# Altium schematic sheet swivel_rev2.SchDoc
size A3
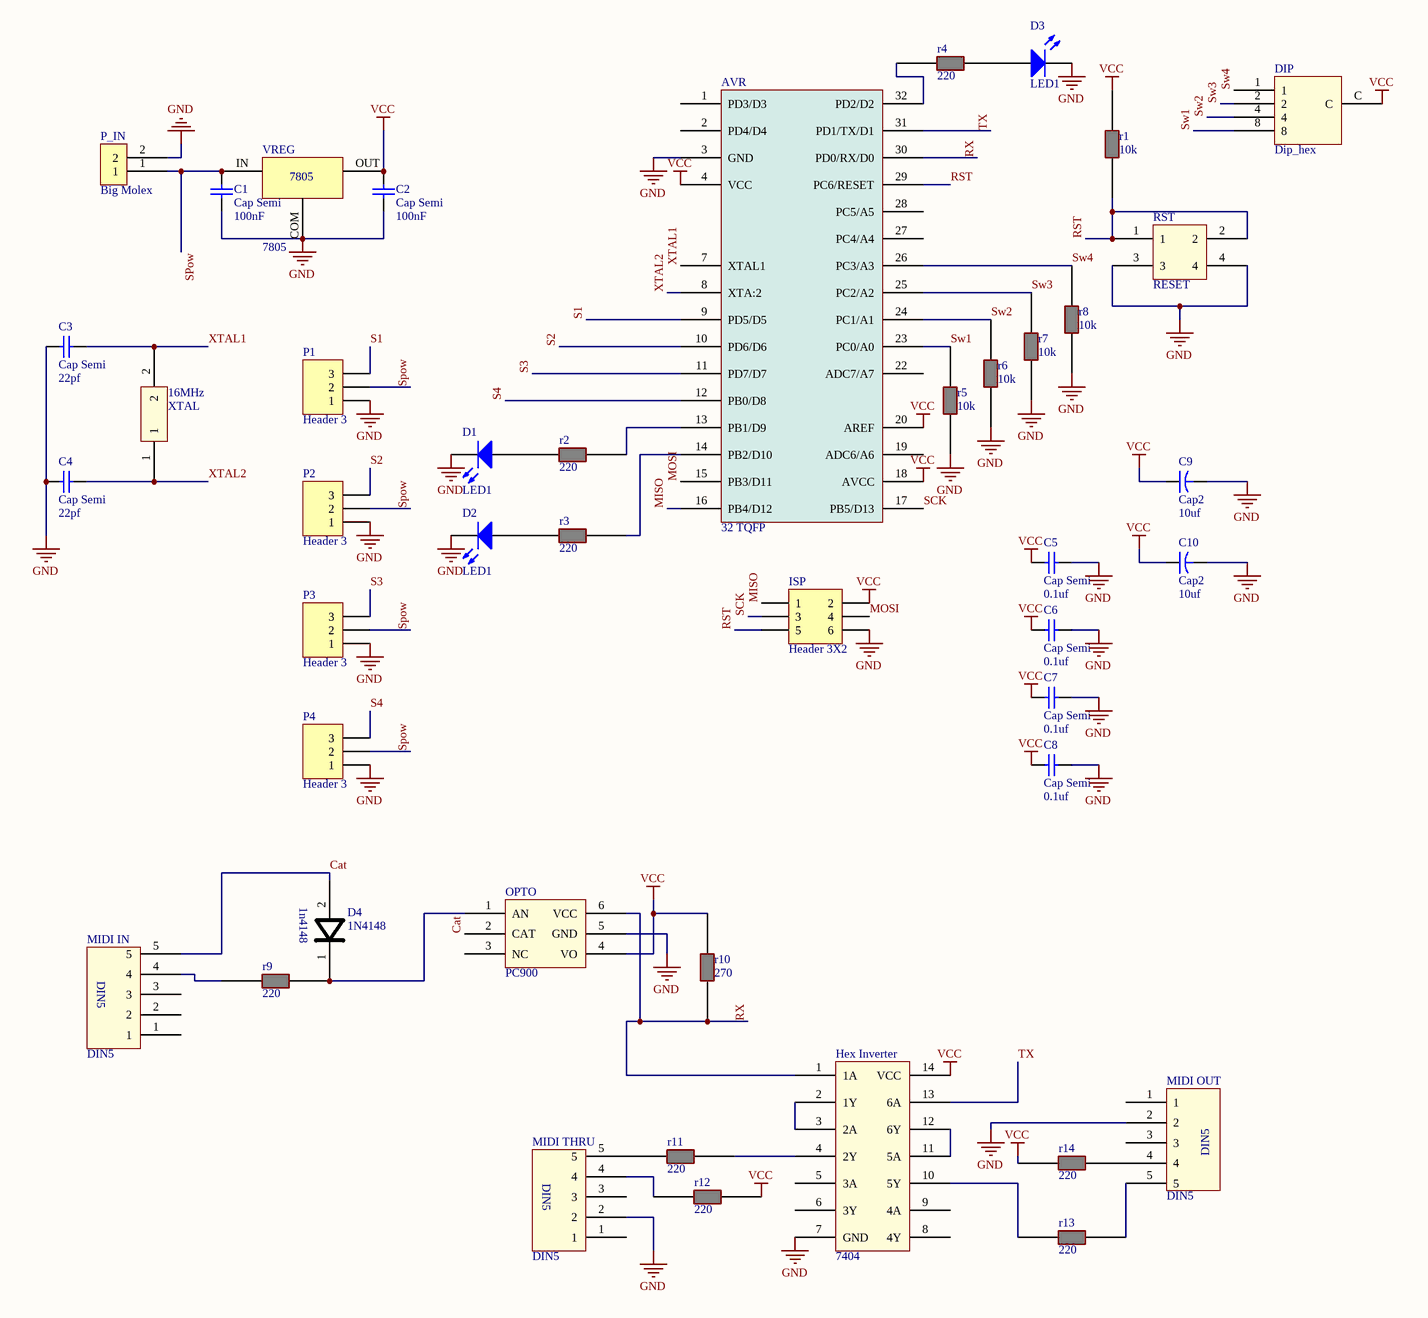
[diagram p0: swivel_rev2.SchDoc]

## Parts
16MHz  XTAL  [XTAL]
AVR  32 TQFP  [ATMEGA328]
C1  Cap Semi  value 100nF  [C1206]
C2  Cap Semi  value 100nF  [C1206]
C3  Cap Semi  value 22pf  [C1206]
C4  Cap Semi  value 22pf  [C1206]
C5  Cap Semi  value 0.1uf  [C1206]
C6  Cap Semi  value 0.1uf  [C1206]
C7  Cap Semi  value 0.1uf  [C1206]
C8  Cap Semi  value 0.1uf  [C1206]
C9  Cap2  value 10uf  [CAPR5-4X5]
C10  Cap2  value 10uf  [CAPR5-4X5]
D1  LED1  [LED-1]
D2  LED1  [LED-1]
D3  LED1  [LED-1]
D4  1N4148  [1N4148W-FDITR-ND]
DIP  Dip_hex  [DIP_Hex]
Hex_Inverter  7404  [7404 TSSOP]
ISP  Header 3X2  [HDR2X3]
MIDI_IN  DIN5  [DIN5]
MIDI_OUT  DIN5  [DIN5]
MIDI_THRU  DIN5  [DIN5]
OPTO  PC900  [PC900]
P1  Header 3  [HDR1X3]
P2  Header 3  [HDR1X3]
P3  Header 3  [HDR1X3]
P4  Header 3  [HDR1X3]
P_IN  Big Molex  [2-Pin Big Molex]
r1  10k  [Resistor 0805]
r2  220  [Resistor 0805]
r3  220  [Resistor 0805]
r4  220  [Resistor 0805]
r5  10k  [Resistor 0805]
r6  10k  [Resistor 0805]
r7  10k  [Resistor 0805]
r8  10k  [Resistor 0805]
r9  220  [Resistor 0805]
r10  270  [Resistor 0805]
r11  220  [Resistor 0805]
r12  220  [Resistor 0805]
r13  220  [Resistor 0805]
r14  220  [Resistor 0805]
RST  RESET  [Reset]
VREG  7805  [7805]

## Nets
GND: AVR.3(GND) C1.1 C2.1 C3.2 C4.2 C5.1 C6.1 C7.1 C8.1 C9.2 C10.2 D1.2(K) D2.2(K) D3.2(K) Hex_Inverter.7(GND) ISP.6 MIDI_OUT.2 MIDI_THRU.2 OPTO.5(GND) P1.1 P2.1 P3.1 P4.1 P_IN.2 r5.2 r6.2 r7.2 r8.2 RST.3 RST.4 VREG.COM
VCC: AVR.4(VCC) AVR.18(AVCC) AVR.20(AREF) C2.2 C5.2 C6.2 C7.2 C8.2 C9.1 C10.1 DIP.C Hex_Inverter.14(VCC) ISP.2 OPTO.4(VO) r1.2 r10.2 r12.1 r14.2 VREG.OUT
Cat: D4.2 MIDI_IN.5 OPTO.2(CAT)
MISO: AVR.16(PB4/D12) ISP.1
MOSI: AVR.15(PB3/D11) ISP.4
RST: AVR.29(PC6/RESET) ISP.5 r1.1 RST.1 RST.2
RX: AVR.30(PD0/RX/D0) Hex_Inverter.1(1A) OPTO.6(VCC) r10.1
S1: AVR.9(PD5/D5) P1.3
S2: AVR.10(PD6/D6) P2.3
S3: AVR.11(PD7/D7) P3.3
S4: AVR.12(PB0/D8) P4.3
SCK: AVR.17(PB5/D13) ISP.3
SPow: C1.2 P1.2 P2.2 P3.2 P4.2 P_IN.1 VREG.IN
Sw1: AVR.23(PC0/A0) DIP.8 r5.1
Sw2: AVR.24(PC1/A1) DIP.4 r6.1
Sw3: AVR.25(PC2/A2) DIP.2 r7.1
Sw4: AVR.26(PC3/A3) DIP.1 r8.1
TX: AVR.31(PD1/TX/D1) Hex_Inverter.13(6A)
XTAL1: 16MHz.2 AVR.7(XTAL1) C3.1
XTAL2: 16MHz.1 AVR.8(XTA:2) C4.1
NetAVR_13: AVR.13(PB1/D9) r2.1
NetAVR_14: AVR.14(PB2/D10) r3.1
NetAVR_32: AVR.32(PD2/D2) r4.1
NetD1_1: D1.1(A) r2.2
NetD2_1: D2.1(A) r3.2
NetD3_1: D3.1(A) r4.2
NetD4_1: D4.1 OPTO.1(AN) r9.2
NetHex_Inverter_2: Hex_Inverter.2(1Y) Hex_Inverter.3(2A)
NetHex_Inverter_4: Hex_Inverter.4(2Y) r11.1
NetHex_Inverter_10: Hex_Inverter.10(5Y) r13.2
NetHex_Inverter_11: Hex_Inverter.11(5A) Hex_Inverter.12(6Y)
NetMIDI_IN_4: MIDI_IN.4 r9.1
NetMIDI_OUT_4: MIDI_OUT.4 r14.1
NetMIDI_OUT_5: MIDI_OUT.5 r13.1
NetMIDI_THRU_4: MIDI_THRU.4 r12.2
NetMIDI_THRU_5: MIDI_THRU.5 r11.2

Not connected (* = marked no-connect by the designer): AVR 1(PD3/D3) 2(PD4/D4) 19(ADC6/A6) 22(ADC7/A7) 27(PC4/A4) 28(PC5/A5); Hex_Inverter 5(3A) 6(3Y) 8(4Y) 9(4A); MIDI_IN 1 2 3; MIDI_OUT 1 3; MIDI_THRU 1 3; OPTO 3(NC)

## Notes on the sheet
- (in symbol 1N4148) 1n4148

## Library data of the parts
C1-C8 = Cap Semi: Capacitor (Semiconductor SIM Model); Published: 8-Jun-2000; LatestRevisionDate: 29-May-2009; LatestRevisionNote: IPC-7351 Footprint Added.; PackageReference: C1206; Publisher: Altium Limited; PackageDescription: Chip Capacitor
C9 C10 = Cap2: Capacitor; Published: 23-Sep-2002; PackageReference: CAPR5-4X5; Publisher: Altium Limited; PackageDescription: Capacitor; 2 Leads
D1-D3 = LED1: Typical RED GaAs LED; Published: 8-Jun-2000; LatestRevisionDate: 08-Jul-2005; LatestRevisionNote: Mech Layer 1 removed.; PackageReference: LED-1; Publisher: Altium Limited; PackageDescription: LED; 2 Leads
ISP = Header 3X2: Header, 3-Pin, Dual row; LatestRevisionDate: 17-Jul-2002; LatestRevisionNote: Re-released for DXP Platform.; Publisher: Altium Limited
P1-P4 = Header 3: Header, 3-Pin; LatestRevisionDate: 17-Jul-2002; LatestRevisionNote: Re-released for DXP Platform.; Publisher: Altium Limited
P_IN = 2-Pin Big Molex: Molex 39-30-1020
r1-r14 = res0805